# Altium schematic sheet 4-20mA Sensor.SchDoc
size A; SheetNumber: 8; SheetTotal: 15
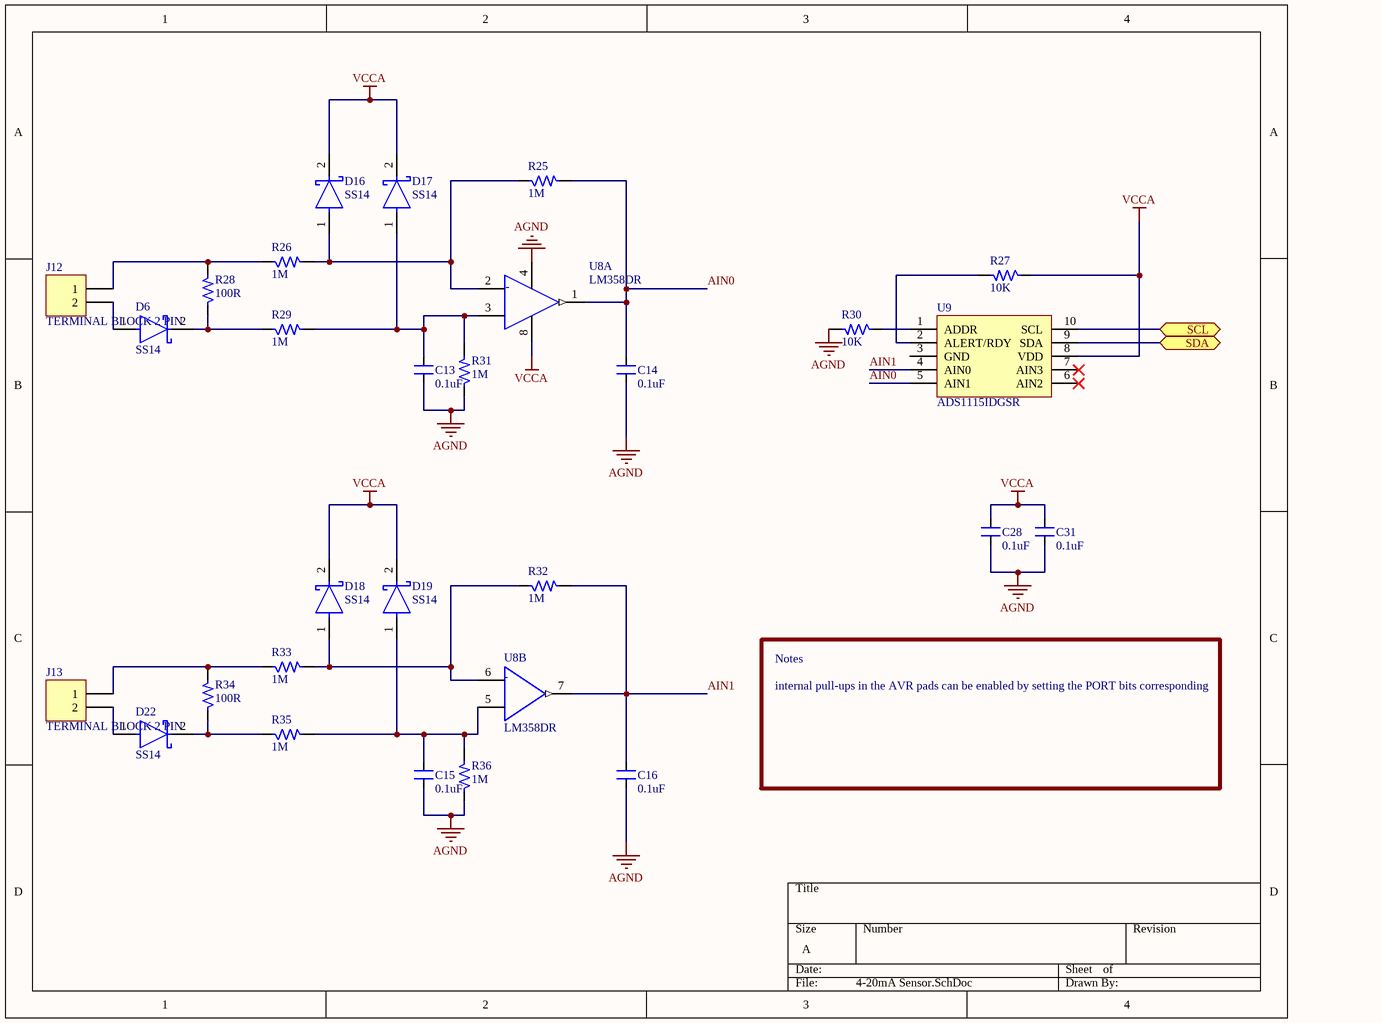
[diagram p0: 4-20mA Sensor.SchDoc]

## Parts
C13  0.1uF  [CAP_0805]
C14  0.1uF  [CAP_0805]
C15  0.1uF  [CAP_0805]
C16  0.1uF  [CAP_0805]
C28  0.1uF  [CAP_0805]
C31  0.1uF  [CAP_0805]
D6  SS14  [FP-403AE-MFG]
D16  SS14  [FP-403AE-MFG]
D17  SS14  [FP-403AE-MFG]
D18  SS14  [FP-403AE-MFG]
D19  SS14  [FP-403AE-MFG]
D22  SS14  [FP-403AE-MFG]
J12  TERMINAL BLOCK 2 PIN  [CON2_P196_1729128_TH_ST]
J13  TERMINAL BLOCK 2 PIN  [CON2_P196_1729128_TH_ST]
R25  1M  [RES_0805]
R26  1M  [RES_0805]
R27  10K  [RES_0805]
R28  100R  [RES_0805]
R29  1M  [RES_0805]
R30  10K  [RES_0805]
R31  1M  [RES_0805]
R32  1M  [RES_0805]
R33  1M  [RES_0805]
R34  100R  [RES_0805]
R35  1M  [RES_0805]
R36  1M  [RES_0805]
U8  LM358DR  [FP-D0008A-IPC_B]  (parts A,B of 2)
U9  ADS1115IDGSR  [VSOP-10_19.6_230_57X12_SMD]

## Ports
SCL (bidir, see Block Diagram[5D], ATMEGA2560-16AU[1C], RTC[1B]), SDA (bidir, see Block Diagram[5D], ATMEGA2560-16AU[1C], RTC[1B])

## Nets
AGND: C13.1 C14.1 C15.1 C16.1 C28.1 C31.1 R30.2 R31.1 R36.1 U8.4(V-)
VCCA: C28.2 C31.2 D16.2(C) D17.2(C) D18.2(C) D19.2(C) R27.1 U8.8(V+) U9.8(VDD)
AIN0: C14.2 R25.2 U8.1(1OUT) U9.5(AIN1)
AIN1: C16.2 R32.2 U8.7(2OUT) U9.4(AIN0)
SCL: U9.10(SCL) ; port SCL
SDA: U9.9(SDA) ; port SDA
NetC13_2: C13.2 D17.1(A) R29.2 R31.2 U8.3(IN1+)
NetC15_2: C15.2 D19.1(A) R35.2 R36.2 U8.5(IN2+)
NetD6_1: D6.1(A) J12.2
NetD6_2: D6.2(C) R28.1 R29.1
NetD16_1: D16.1(A) R25.1 R26.2 U8.2(IN1-)
NetD18_1: D18.1(A) R32.1 R33.2 U8.6(IN2-)
NetD22_1: D22.1(A) J13.2
NetD22_2: D22.2(C) R34.1 R35.1
NetJ12_1: J12.1 R26.1 R28.2
NetJ13_1: J13.1 R33.1 R34.2
NetR27_2: R27.2 U9.2(ALERT/RDY)
NetR30_1: R30.1 U9.1(ADDR)

Not connected (* = marked no-connect by the designer): U9 3(GND) 6(AIN2)* 7(AIN3)*

## Notes on the sheet
- Notes
- internal pull-ups in the AVR pads can be enabled by setting the PORT bits corresponding
- (in symbol LM358, part A) -
- (in symbol LM358, part B) -

## Library data of the parts
C13-C16 C28 C31 = CAP_0.1uF-50V-5%-0805: 0.1µF ±5% 50V Ceramic Capacitor X7R 0805 (2012 Metric); Manufacturer: AVX Corporation; Manufacturer Part Number: 08055C104JAT4A; Alternate Part Number-1: 0805B104M500; Case/Package: 0805; Supplier-1: SIRICOM; Supplier Part Number-1: 0805B104J500CT
D6 D16-D19 D22 = SS14: DIODE SCHOTTKY 40V 1A SMA; Manufacturer: ON Semiconductor; Peak Reverse Current: 0.2mA; Max Junction Temp: +125°C; Standoff Height: 0.05mm; Max Surge Forward Current: 40A; Mouser Description: Schottky Diodes & Rectifiers SMA 40V 1.0A; RoHS: TRUE; Lead Free: Yes; Manufacturer Part Number: SS14; Device Class L3: Schottky Diodes; Category: Diode; Automotive: No; Digikey Description: DIODE SCHOTTKY 40V 1A SMA; ComponentLink2Description: Datasheet; Device Class L2: Diodes; Height: 2.5mm; Temperature Range High: +125°C; ComponentLink2URL: https://www.onsemi.com/pub/Collateral/SS19-D.PDF; Device Class L1: Discrete Semiconductors; Package: 403AE; Octopart: https://octopart.com/ss14-on+semiconductor-29205033; Max Repetitive Reverse Voltage: 40V; Temperature Range Low: -65°C; Forward Current: 1A; Temperature: -65°C to +125°C
J12 J13 = CON-TB_2X1-196-ST-TH: 2 Pins, 1 Row 5mm Pitch, straight Connector, male; Manufacturer: Phoenix Contact; Manufacturer Part Number: MKDSN1,5/2; Alternate Part Number-1: NA; Case/Package: TH-CON; Supplier-1: SP ROAD; Supplier Part Number-1: MKDSN1,5/2
R25 R26 R29 R31-R33 R35 R36 = RES_1M-0.125W-1%-0805: 1 MOhms ±1% 0.125W, 1/8W Chip Resistor 0805 (2012 Metric) Automotive AEC-Q200 Thick Film; Manufacturer: Walsin; Manufacturer Part Number: WR08X1004FTL; Alternate Part Number-1: 0805W8F1004T5E; Case/Package: 0805; Supplier-1: SIRICOM; Supplier Part Number-1: WR08X1004FTL
R27 R30 = RES_10K-0.125W-1%-0805: 10 kOhms ±1% 0.125W, 1/8W Chip Resistor 0805 (2012 Metric) Automotive AEC-Q200 Thick Film; Manufacturer: CTS; Manufacturer Part Number: WR08X1002FTL; Case/Package: 0805; Supplier-1: SIRICOM; Supplier Part Number-1: WR08X1002FTL; Alternate Part Number-1: WR08X1002FTL
R28 R34 = RES_100R-0.125W-1%-0805: 100 Ohms ±1% 0.125W, 1/8W Chip Resistor 0805 (2012 Metric) Automotive AEC-Q200, Pulse Withstanding Thick Film; Manufacturer: Walsin; Manufacturer Part Number: WR08X1000FTL; Case/Package: 0805; Supplier-1: SIRICOM; Supplier Part Number-1: WR08X1000FTL; Alternate Part Number-1: WR08X1000FTL
U8 = LM358: IC OPAMP GP 2 CIRCUIT 8SOIC; Output Current: 30mA; Min Dual Supply Voltage: 1.5V; Input Offset Voltage (Vos): 7mV; Power Supply Rejection Ratio (PSRR): 65dB; Unity Gain Bandwidth Product: 700kHz; Number of Channels: 2; Min Supply Voltage: 3V; Max Dual Supply Voltage: 16V; Dual Supply Voltage: 9V; Max Supply Voltage: 32V; Nominal Supply Current: 1.2mA; Slew Rate: 0.3V/µs; Input Bias Current: 250nA; Voltage Gain: 100dB; Operating Supply Current: 1mA; REACH SVHC: No SVHC; Package Quantity: 2500; Width: 3.91mm; Max Operating Temperature: 70°C; Min Operating Temperature: 0°C; Mount: Surface Mount; Length: 4.9mm; Radiation Hardening: No; Case/Package: SOIC; Lead Free: Lead Free; Number of Elements: 2; Packaging: Tape and Reel; Output Current per Channel: 30mA; Number of Circuits: 2; Bandwidth: 700kHz; Operating Supply Voltage: 16V; Gain Bandwidth Product: 700kHz; Number of Pins: 8; Number of Amplifiers: 2; Height: 1.58mm; Common Mode Rejection Ratio: 65dB; Contact Plating: Gold
U9 = IC_ADS1115IDGSR: Analog to Digital Converters - ADC 16B ADC w/ Int MUX PGA Comp Osc & Ref; Manufacturer: Texas Instruments; Alternate Part Number-1: NA; Manufacturer Part Number: ADS1115IDGSR; Case/Package: MSOP-10; Supplier-1: Mouser; Supplier Part Number-1: 595-ADS1115IDGSR